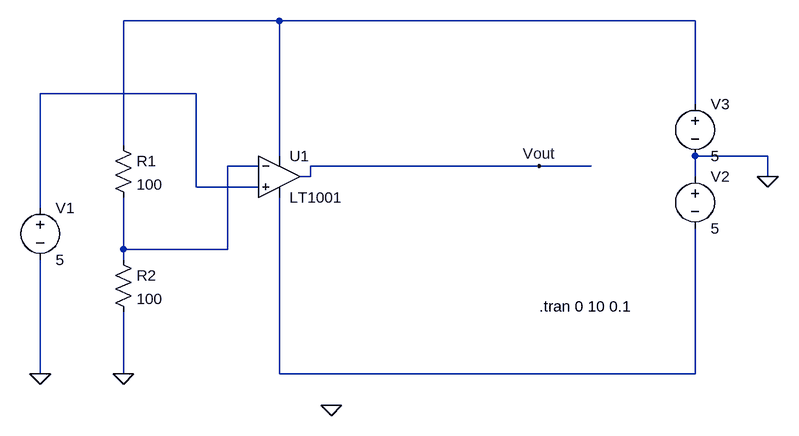
[diagram p0: schematic Draft15.asc]
Draft15.asc, the LTspice schematic file:
Version 4
SHEET 1 912 680
WIRE 144 48 -96 48
WIRE 784 48 144 48
WIRE 16 160 -224 160
WIRE 784 176 784 48
WIRE -96 240 -96 48
WIRE 144 256 144 48
WIRE 896 256 784 256
WIRE 112 272 64 272
WIRE 544 272 192 272
WIRE 624 272 544 272
WIRE 192 288 192 272
WIRE 192 288 176 288
WIRE 784 288 784 256
WIRE 896 288 896 256
WIRE 16 304 16 160
WIRE 112 304 16 304
WIRE -224 336 -224 160
WIRE -96 400 -96 320
WIRE 64 400 64 272
WIRE 64 400 -96 400
WIRE -96 416 -96 400
WIRE -224 592 -224 416
WIRE -96 592 -96 496
WIRE 144 592 144 320
WIRE 784 592 784 368
WIRE 784 592 144 592
FLAG 224 640 0
FLAG 544 272 Vout
FLAG -96 592 0
FLAG -224 592 0
FLAG 896 288 0
SYMBOL Opamps/LT1001 144 224 R0
SYMATTR InstName U1
SYMBOL res -112 224 R0
SYMATTR InstName R1
SYMATTR Value 100
SYMBOL res -112 400 R0
SYMATTR InstName R2
SYMATTR Value 100
SYMBOL voltage -224 320 R0
SYMATTR InstName V1
SYMATTR Value 5
SYMBOL voltage 784 272 R0
SYMATTR InstName V2
SYMATTR Value 5
SYMBOL voltage 784 160 R0
SYMATTR InstName V3
SYMATTR Value 5
TEXT 544 488 Left 2 !.tran 0 10 0.1

The netlist it stands for:
* Draft15.asc
XU1 N002 N003 N001 N004 Vout LT1001  ; pins In+ In- V+ V- OUT
R1 N001 N003 100
R2 N003 0 100
V1 N002 0 5
V2 0 N004 5
V3 N001 0 5
.tran 0 10 0.1
.lib LTC.lib
.backanno
.end